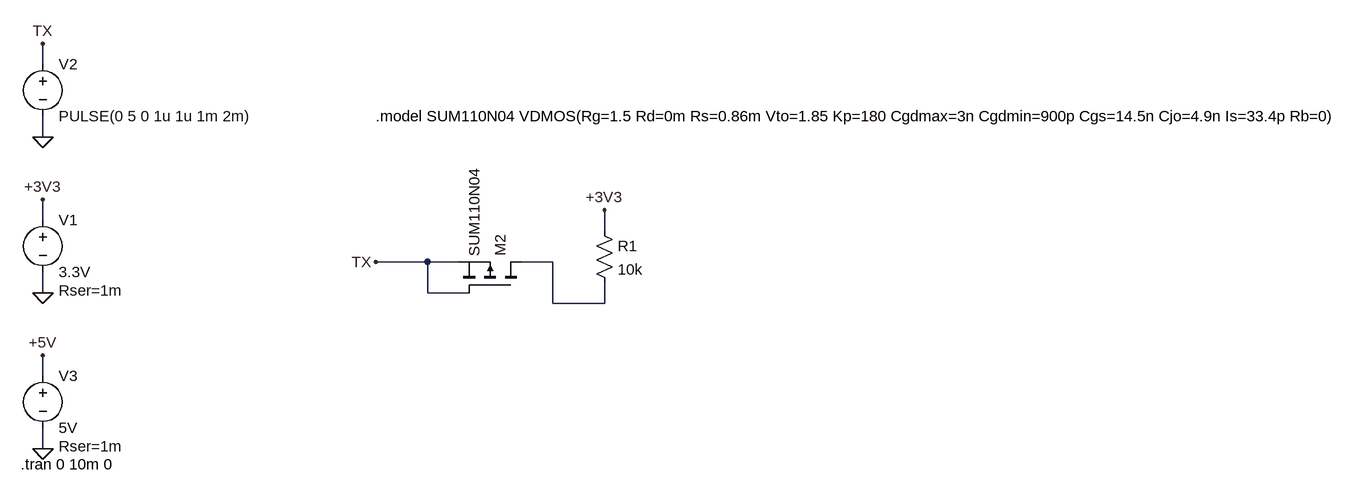
[diagram p0: schematic mosfet.asc]
mosfet.asc, the LTspice schematic file:
Version 4
SHEET 1 1936 680
WIRE -304 -192 -304 -224
WIRE -304 -80 -304 -112
WIRE -304 48 -304 16
WIRE 560 64 560 32
WIRE 288 112 208 112
WIRE 336 112 288 112
WIRE 480 112 432 112
WIRE -304 160 -304 128
WIRE 288 160 288 112
WIRE 352 160 288 160
WIRE 480 176 480 112
WIRE 560 176 560 144
WIRE 560 176 480 176
WIRE -304 288 -304 256
WIRE -304 400 -304 368
FLAG -304 160 0
FLAG -304 16 +3V3
FLAG -304 -80 0
FLAG -304 -224 TX
FLAG -304 400 0
FLAG -304 256 +5V
FLAG 208 112 TX
FLAG 560 32 +3V3
SYMBOL voltage -304 32 R0
WINDOW 123 0 0 Left 2
WINDOW 39 24 124 Left 2
SYMATTR InstName V1
SYMATTR Value 3.3V
SYMATTR SpiceLine Rser=1m
SYMBOL voltage -304 -208 R0
WINDOW 123 0 0 Left 2
WINDOW 39 0 0 Left 2
SYMATTR InstName V2
SYMATTR Value PULSE(0 5 0 1u 1u 1m 2m)
SYMBOL voltage -304 272 R0
WINDOW 123 0 0 Left 2
WINDOW 39 24 124 Left 2
SYMATTR InstName V3
SYMATTR Value 5V
SYMATTR SpiceLine Rser=1m
SYMBOL pmos 432 160 M270
SYMATTR InstName M2
SYMATTR Value SUM110N04
SYMBOL res 544 48 R0
SYMATTR InstName R1
SYMATTR Value 10k
SYMATTR SpiceLine tol=5 pwr=0.25
TEXT -338 424 Left 2 !.tran 0 10m 0
TEXT 208 -112 Left 2 !.model SUM110N04 VDMOS(Rg=1.5 Rd=0m Rs=0.86m Vto=1.85 Kp=180 Cgdmax=3n Cgdmin=900p Cgs=14.5n Cjo=4.9n Is=33.4p Rb=0)

The netlist it stands for:
* mosfet.asc
V1 +3V3 0 3.3V Rser=1m
V2 TX 0 PULSE(0 5 0 1u 1u 1m 2m)
V3 +5V 0 5V Rser=1m
M2 N001 TX TX TX SUM110N04
R1 +3V3 N001 10k tol=5 pwr=0.25
.model NMOS NMOS
.model PMOS PMOS
.lib standard.mos
.tran 0 10m 0
.model SUM110N04 VDMOS(Rg=1.5 Rd=0m Rs=0.86m Vto=1.85 Kp=180 Cgdmax=3n Cgdmin=900p Cgs=14.5n Cjo=4.9n Is=33.4p Rb=0)
.backanno
.end